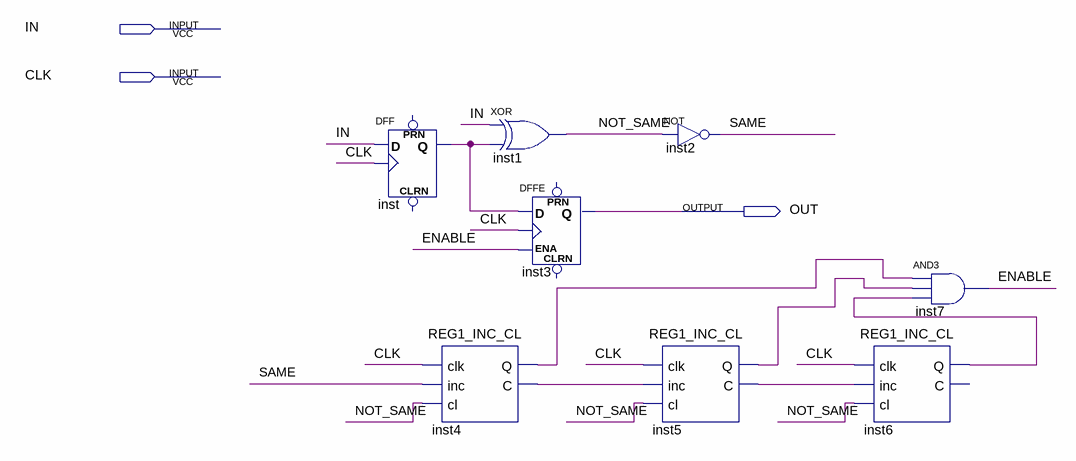
[diagram p0: schematic sheet]
// Quartus schematic Debouncer.bdf as structural Verilog: 8 symbols, 3 pins
module Debouncer (
  input  IN,
  input  CLK,
  output OUT
);

  wire ENABLE, inst4_c, inst4_q, inst5_c, inst5_q, inst6_q, inst_q, NOT_SAME, SAME;

  DFF inst (.CLK(CLK), .D(IN), .Q(inst_q));  // open: CLRN, PRN
  REG1_INC_CL inst4 (.clk(CLK), .inc(SAME), .cl(NOT_SAME), .Q(inst4_q), .C(inst4_c));
  xor inst1 (NOT_SAME, IN, inst_q);
  DFFE inst3 (.D(inst_q), .CLK(CLK), .ENA(ENABLE), .Q(OUT));  // open: PRN, CLRN
  not inst2 (SAME, NOT_SAME);
  REG1_INC_CL inst5 (.clk(CLK), .inc(inst4_c), .cl(NOT_SAME), .Q(inst5_q), .C(inst5_c));
  REG1_INC_CL inst6 (.clk(CLK), .inc(inst5_c), .cl(NOT_SAME), .Q(inst6_q));  // open: C
  and inst7 (ENABLE, inst4_q, inst5_q, inst6_q);
endmodule
